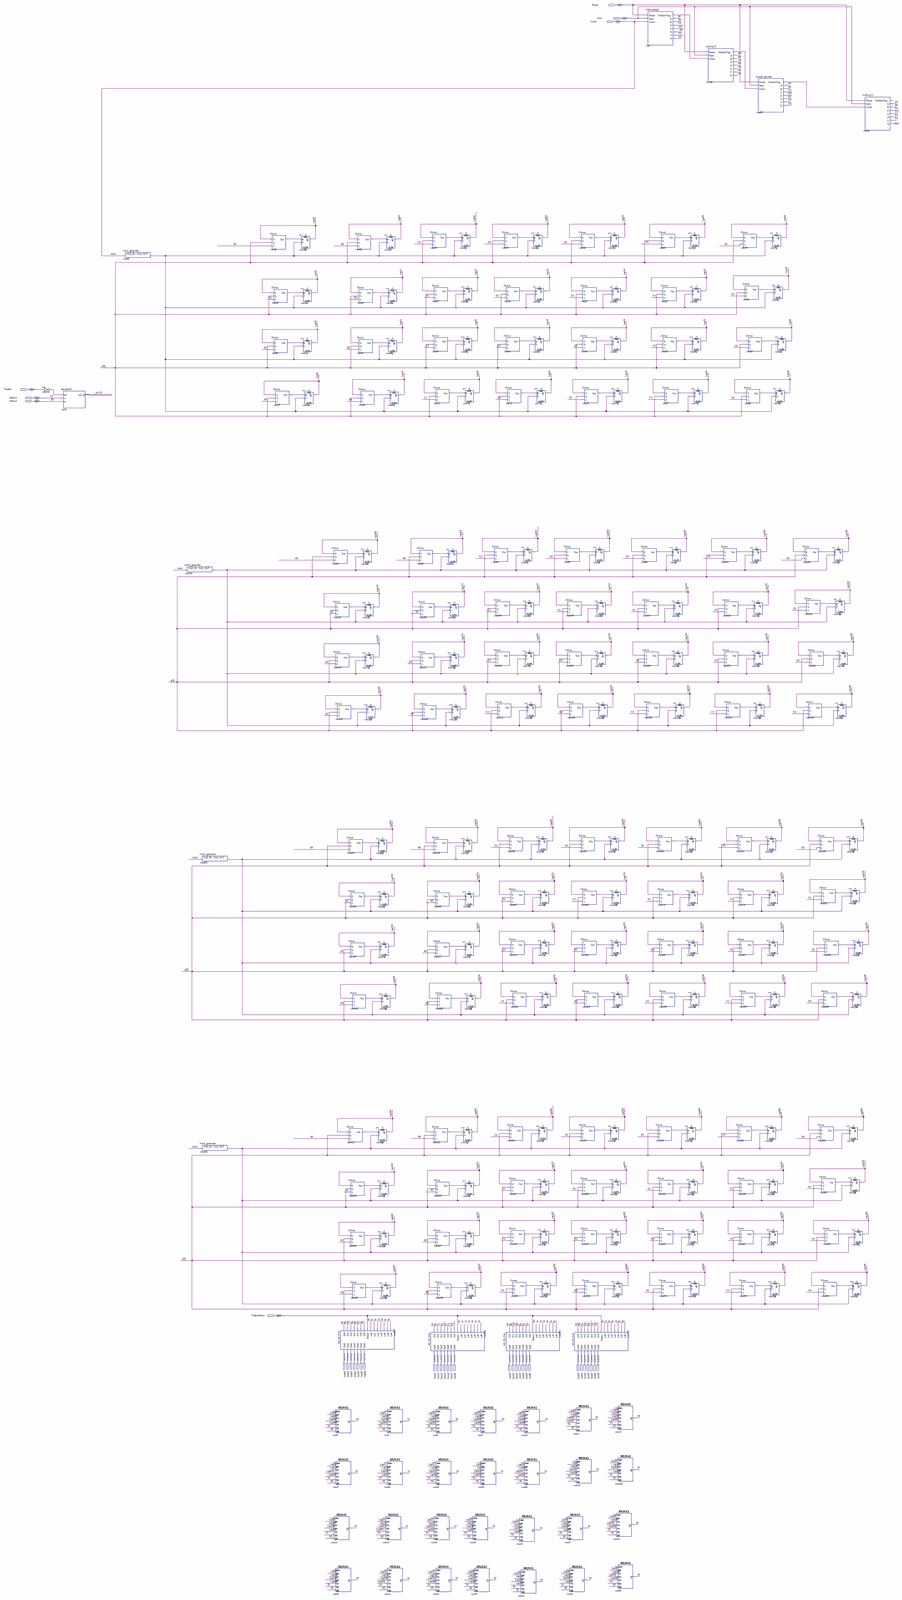
[diagram p0: schematic sheet, whole]
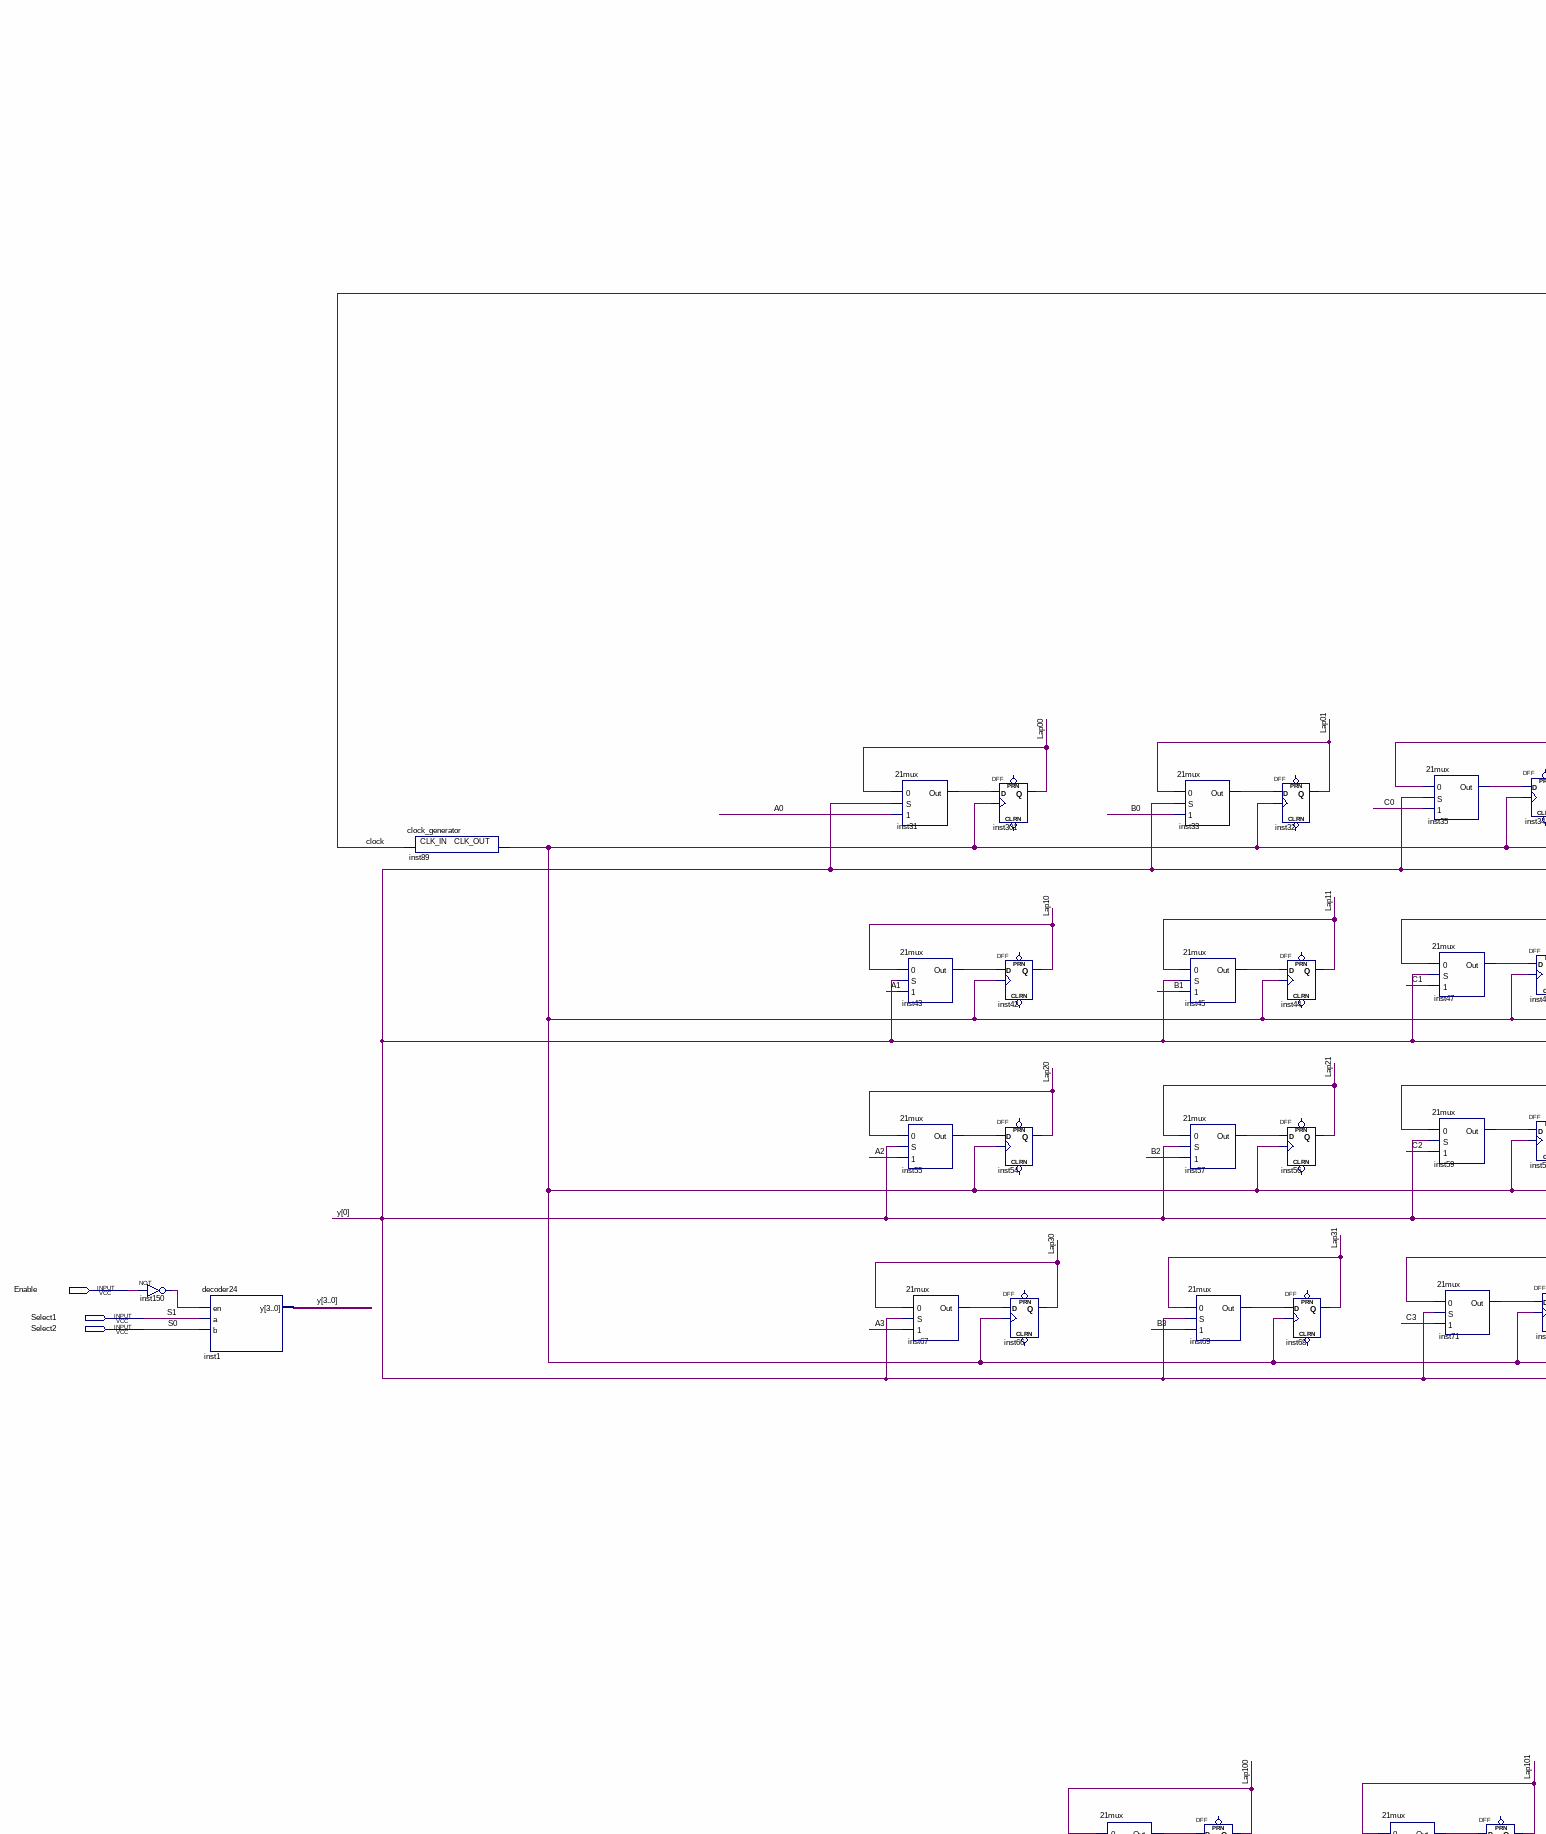
[diagram p1: schematic sheet, upper left part]
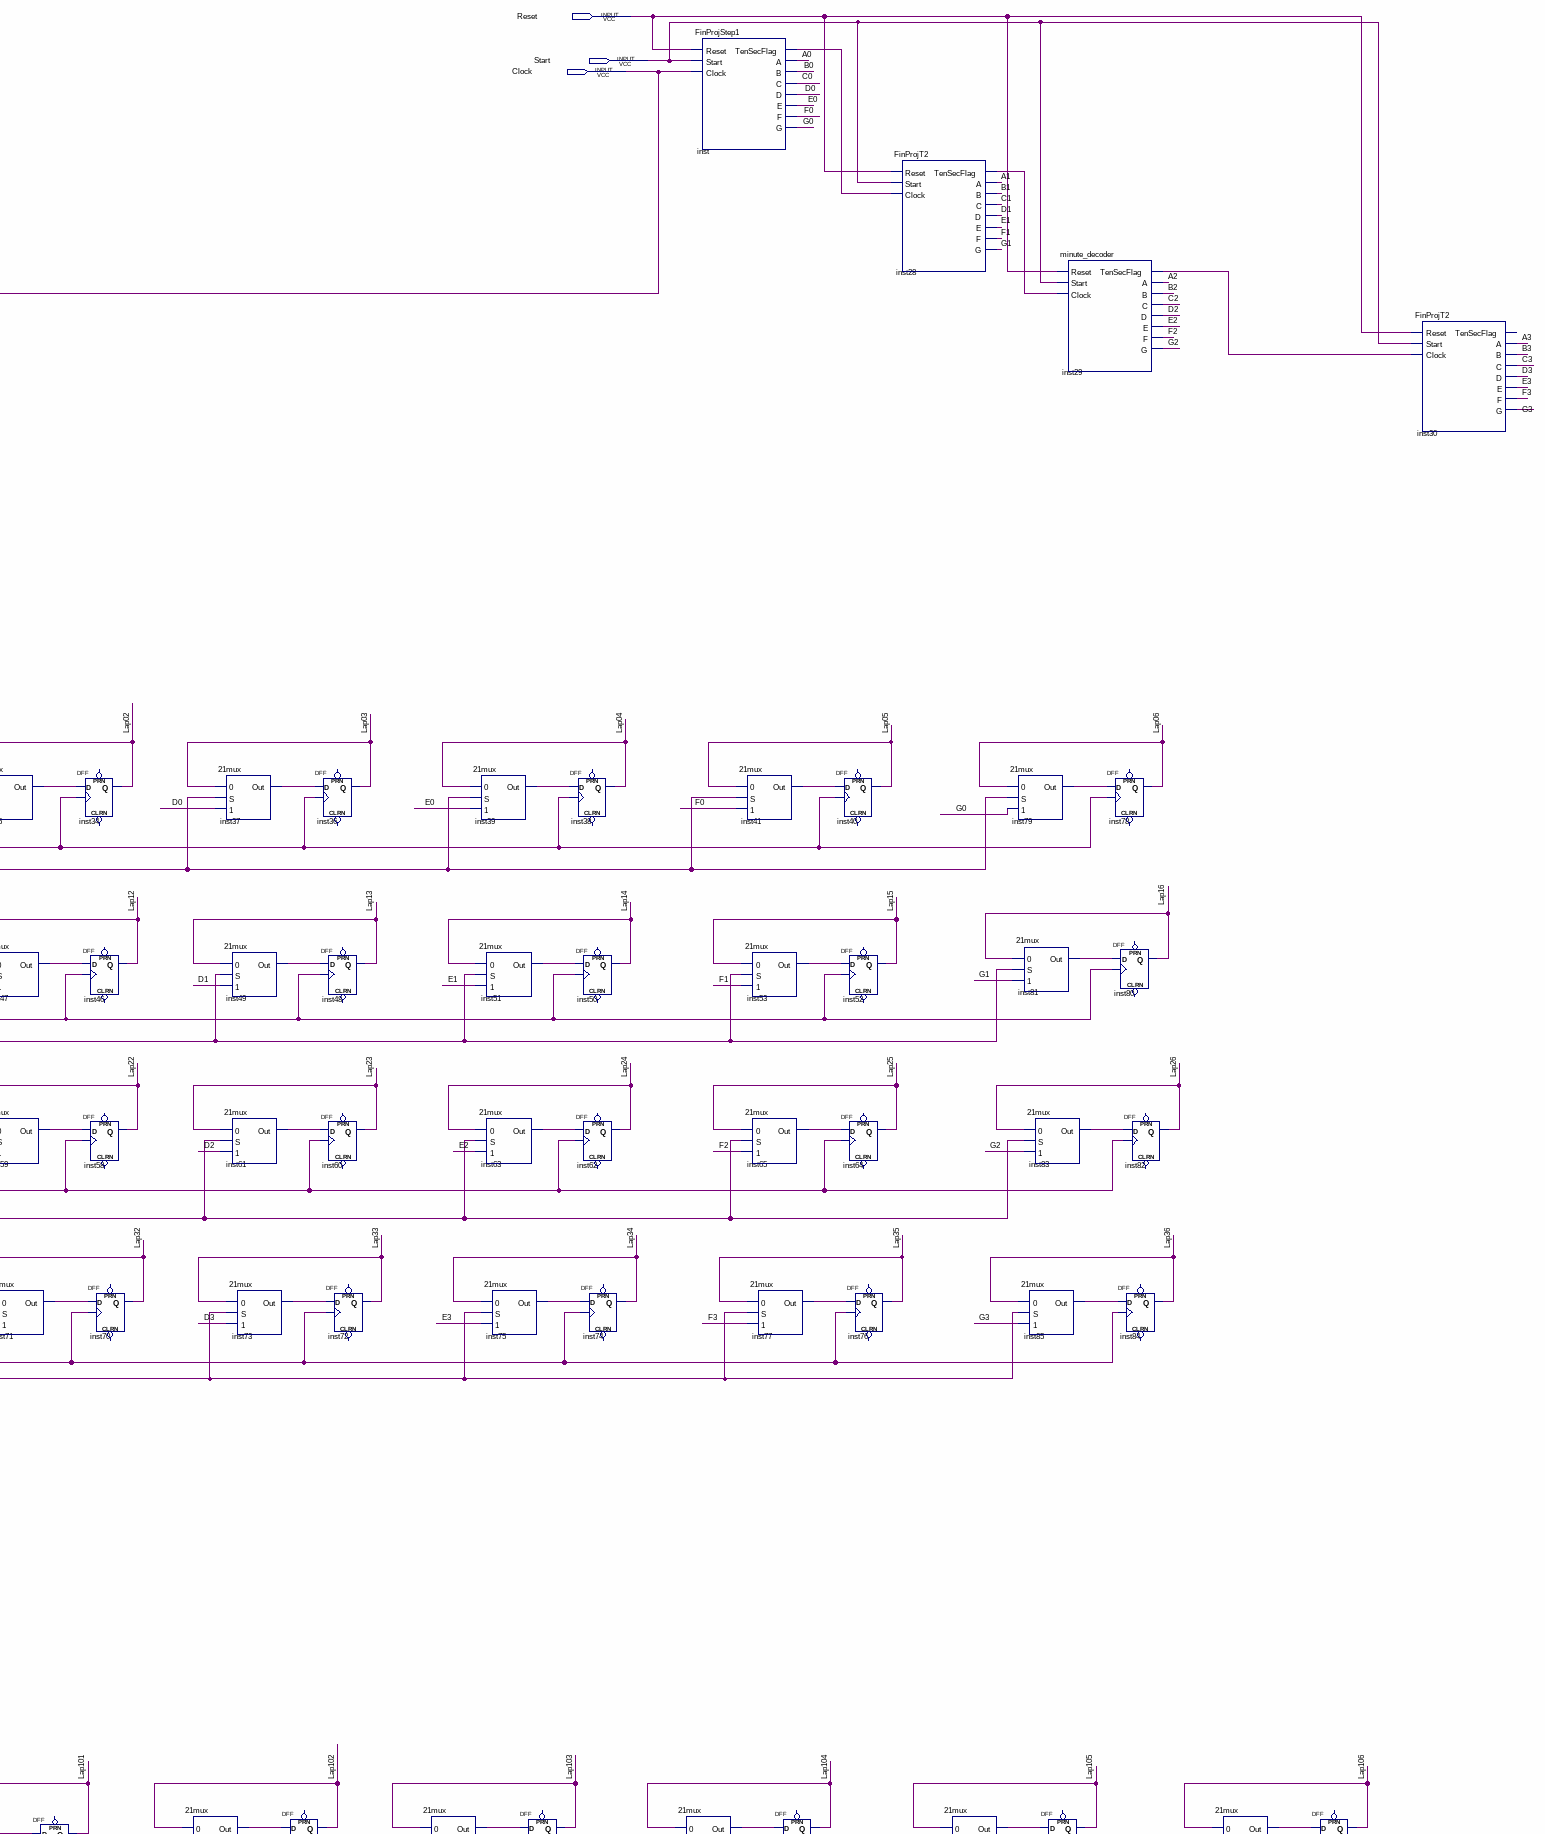
[diagram p2: schematic sheet, upper right part]
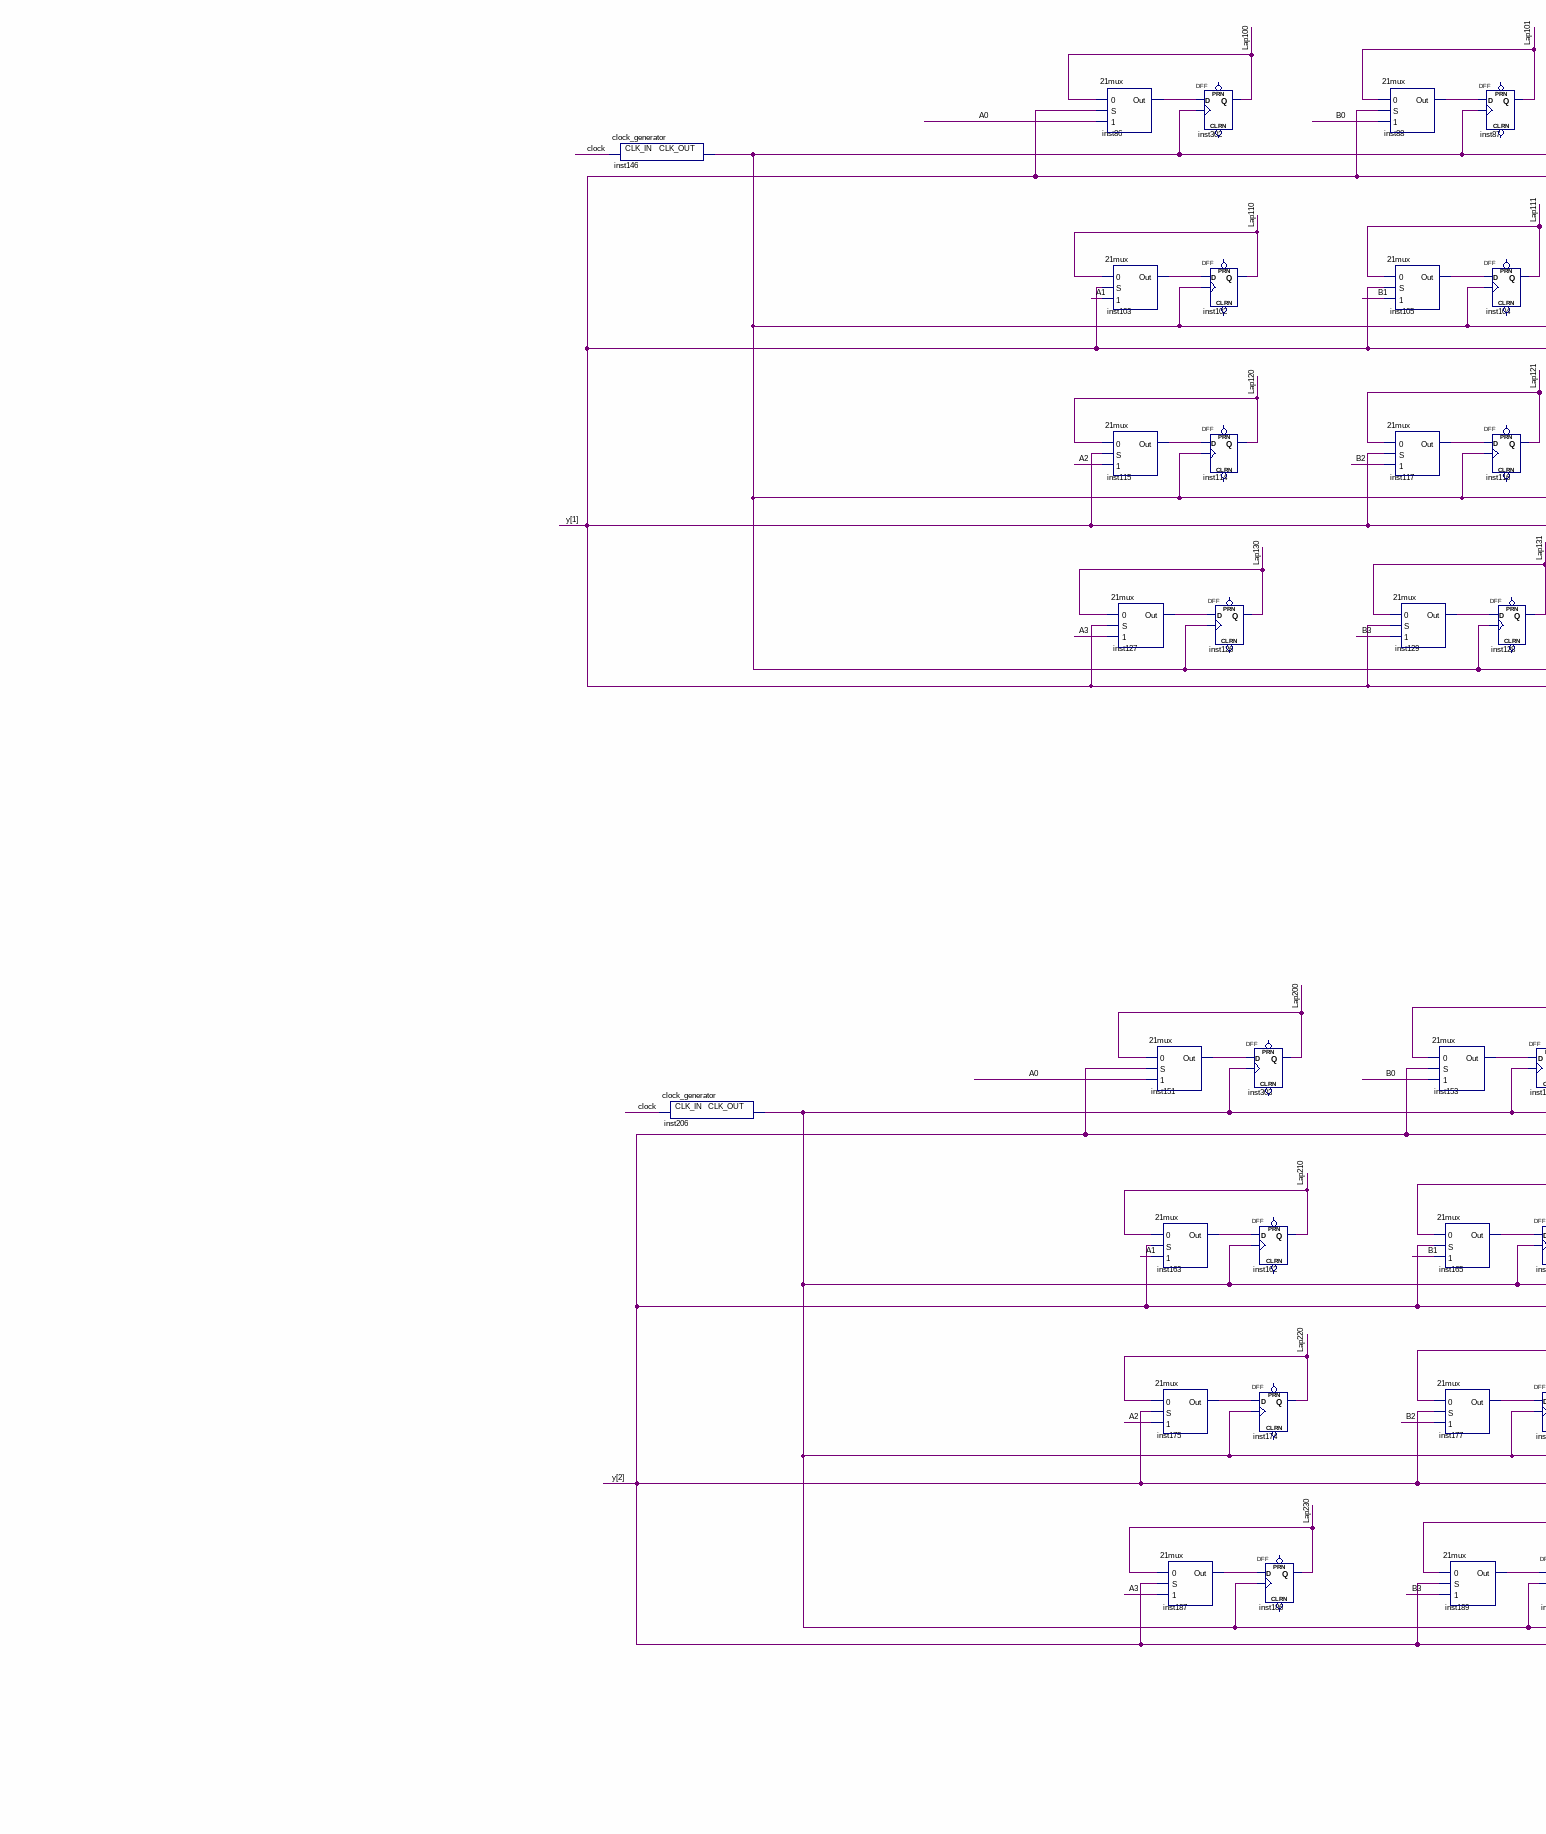
[diagram p3: schematic sheet, middle left part]
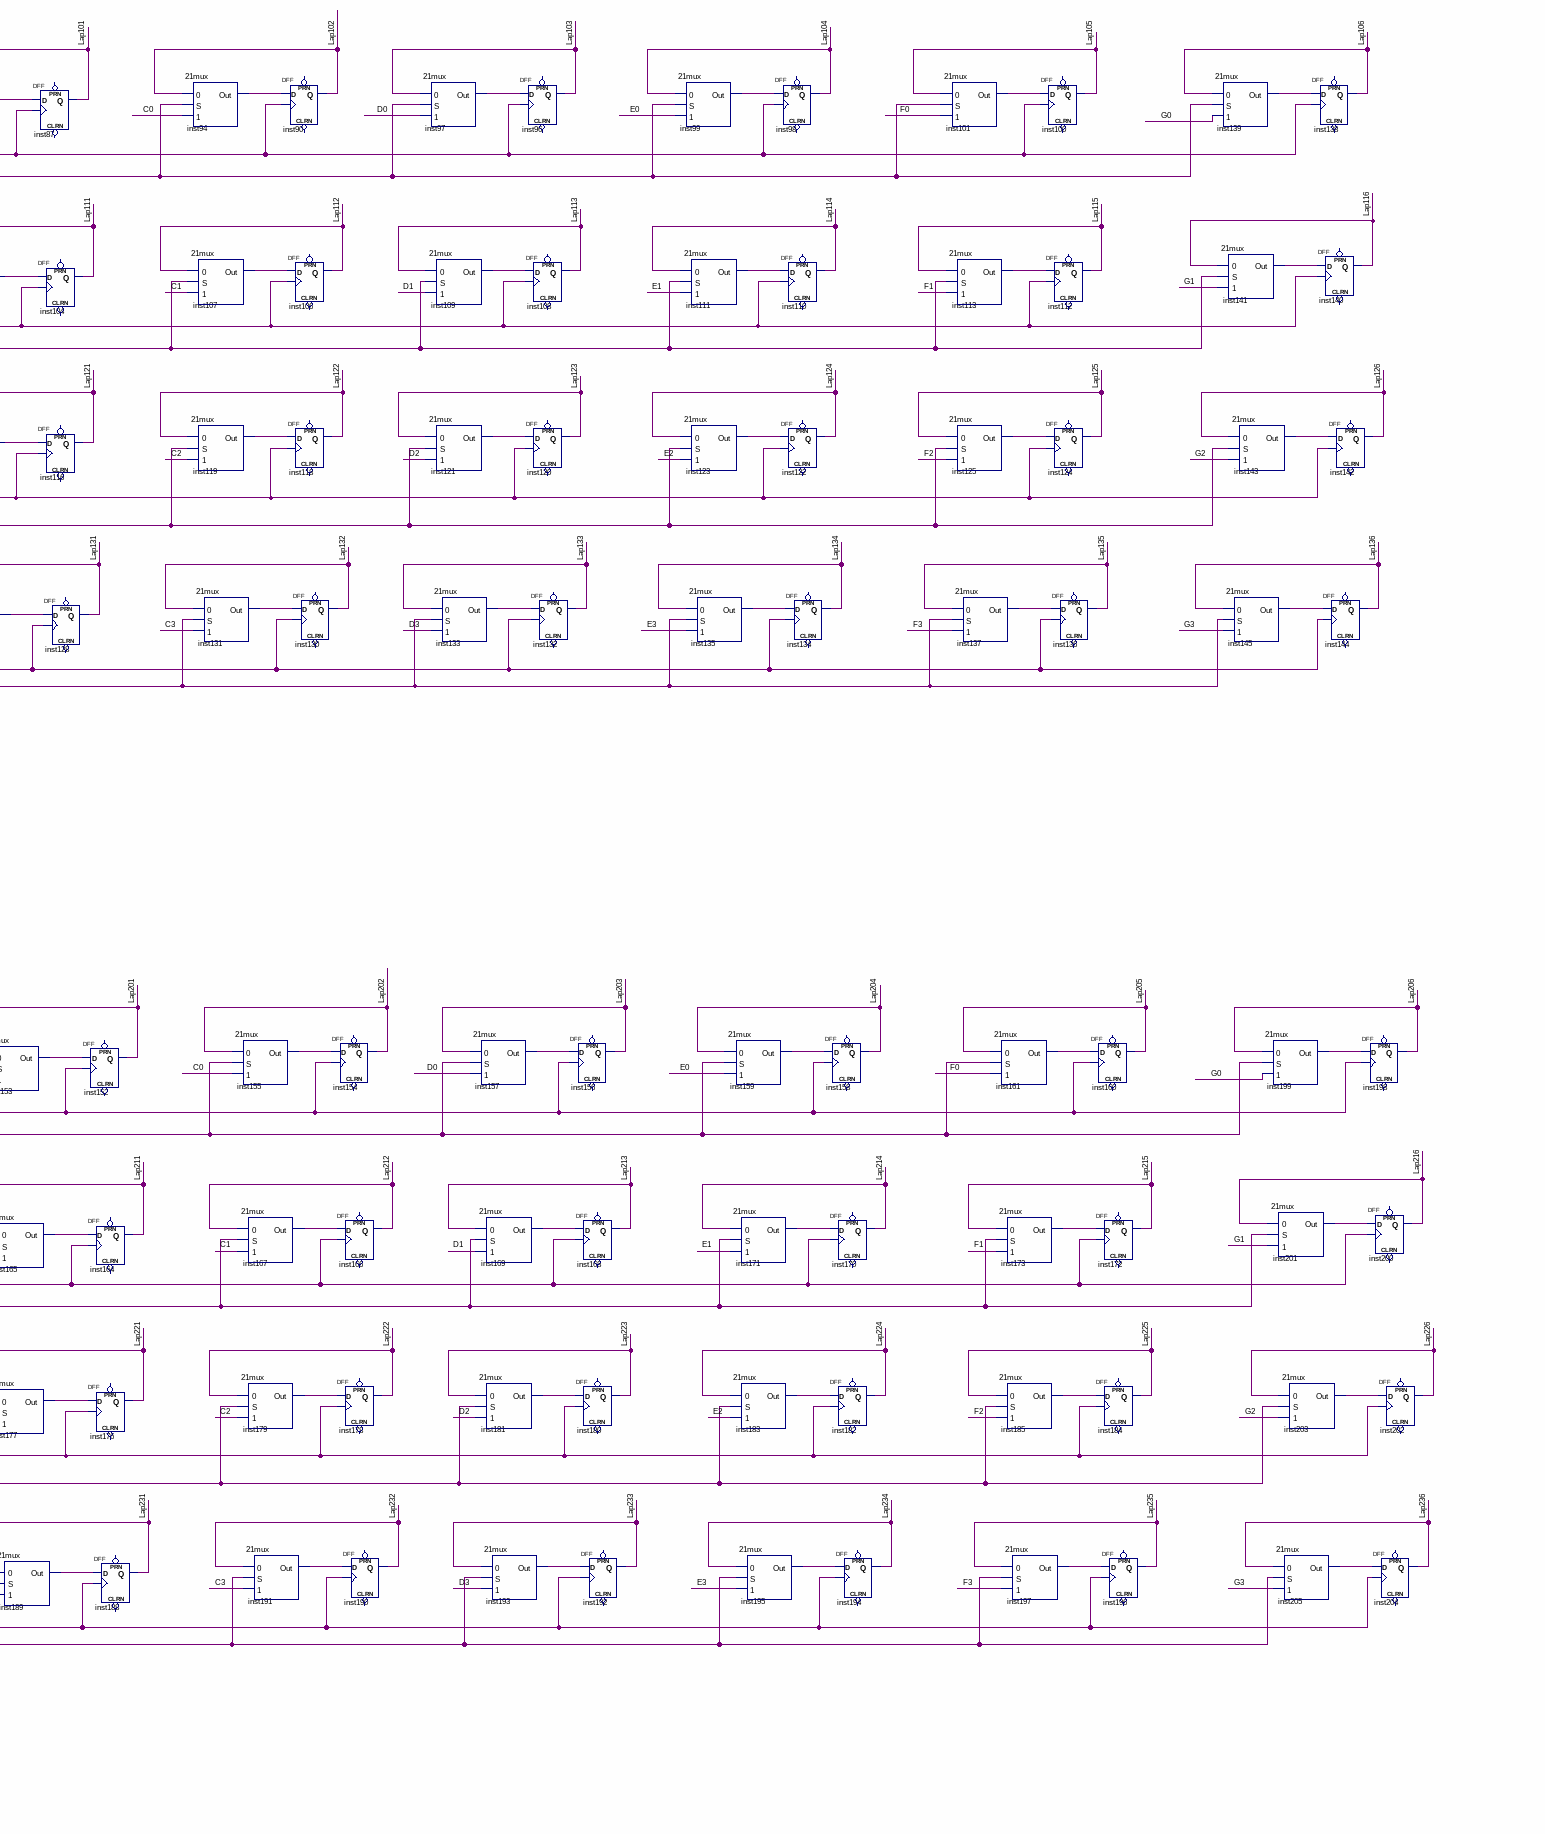
[diagram p4: schematic sheet, middle right part]
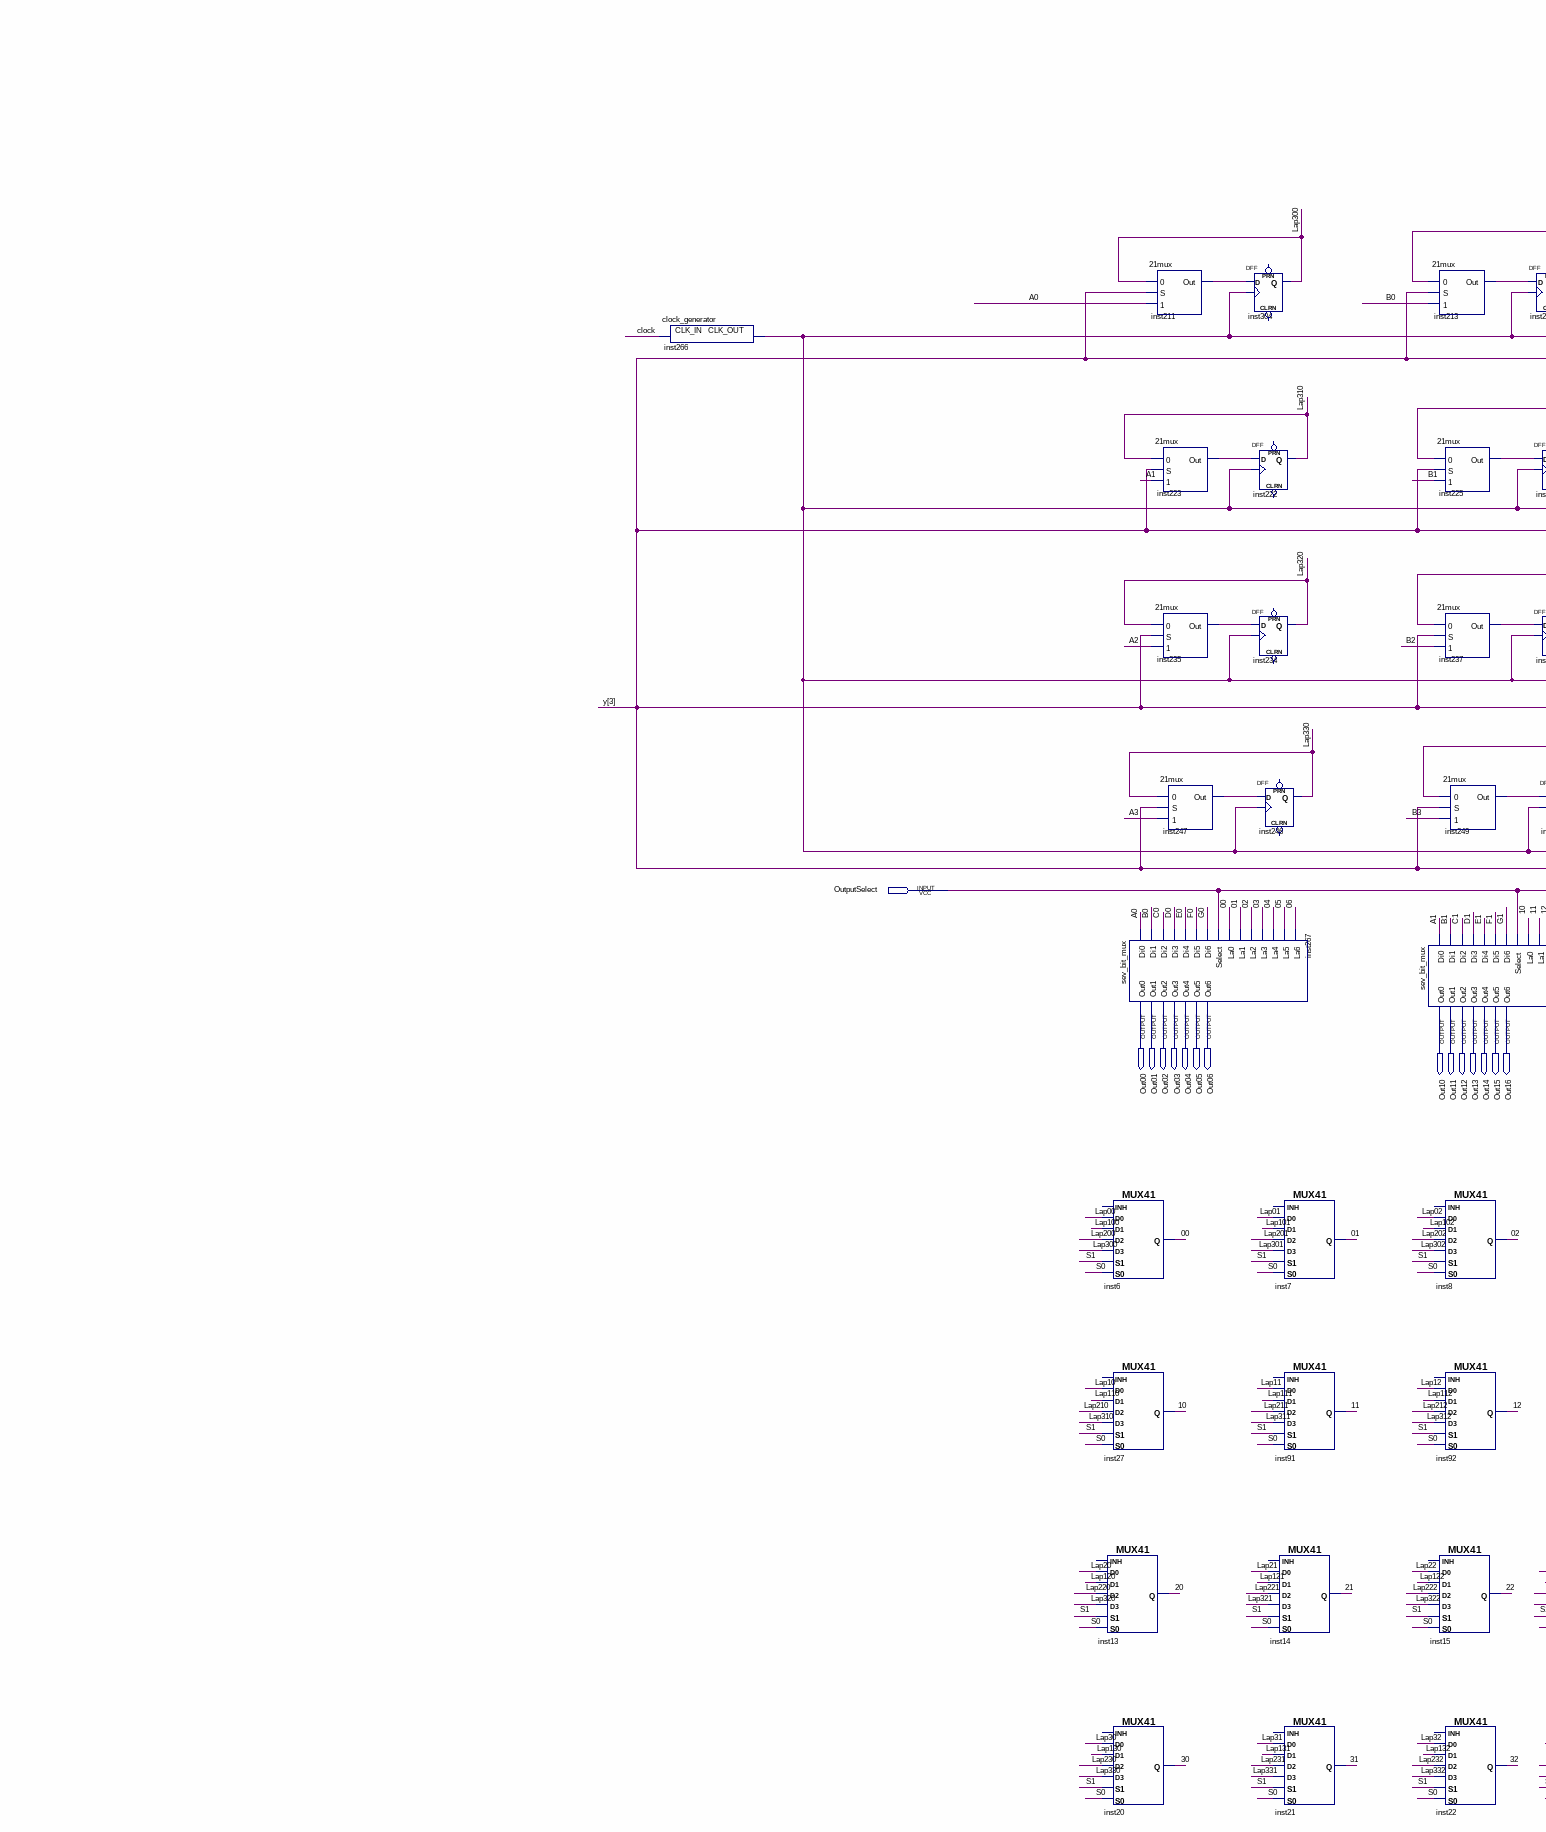
[diagram p5: schematic sheet, lower left part]
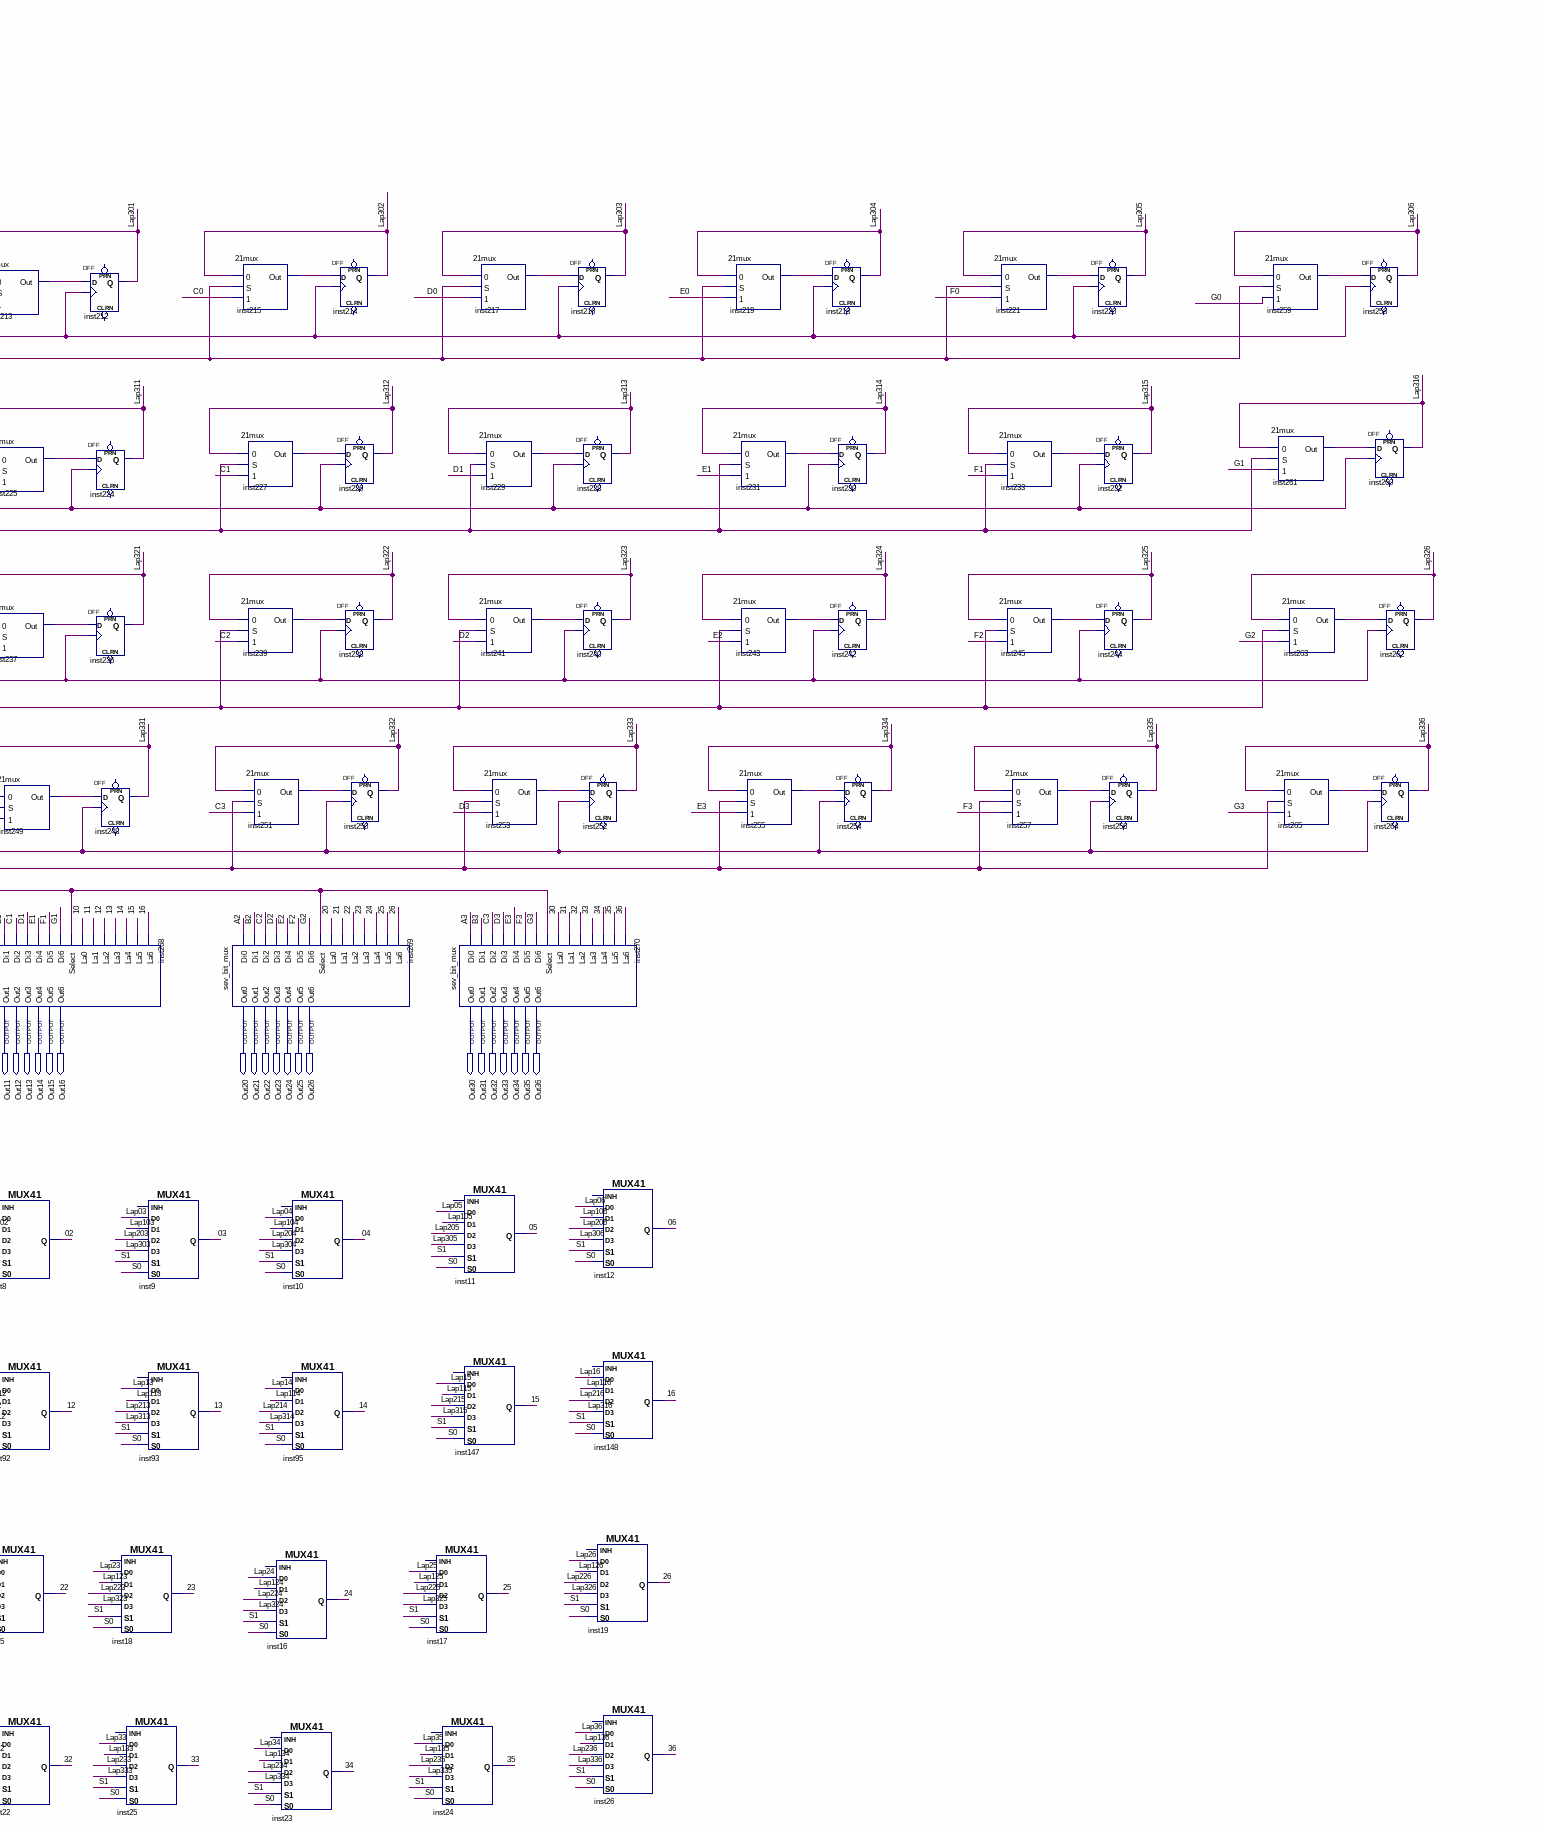
[diagram p6: schematic sheet, lower right part]
// Quartus schematic FinProjFin.bdf as structural Verilog: 266 symbols, 35 pins
module FinProjFin (
  input  Reset,
  input  Start,
  input  Clock,
  input  Enable,
  input  Select1,
  input  Select2,
  input  OutputSelect,
  output Out00,
  output Out01,
  output Out02,
  output Out03,
  output Out04,
  output Out05,
  output Out06,
  output Out10,
  output Out11,
  output Out12,
  output Out13,
  output Out14,
  output Out15,
  output Out16,
  output Out20,
  output Out21,
  output Out22,
  output Out23,
  output Out24,
  output Out25,
  output Out26,
  output Out30,
  output Out31,
  output Out32,
  output Out33,
  output Out34,
  output Out35,
  output Out36
);

  wire \00 , \01 , \02 , \03 , \04 , \05 , \06 , \10 , \11 , \12 , \13 , \14 , \15 , \16 , \20 , \21 , \22 ,
       \23 , \24 , \25 , \26 , \30 , \31 , \32 , \33 , \34 , \35 , \36 , A0, A1, A2, A3, B0, B1, B2, B3, C0,
       C1, C2, C3, D0, D1, D2, D3, E0, E1, E2, E3, F0, F1, F2, F3, G0, G1, G2, G3, inst28_tensecflag,
       inst29_tensecflag, inst31_out, inst33_out, inst35_out, inst37_out, inst39_out, inst41_out, inst43_out,
       inst45_out, inst47_out, inst49_out, inst51_out, inst53_out, inst55_out, inst57_out, inst59_out,
       inst61_out, inst63_out, inst65_out, inst67_out, inst69_out, inst71_out, inst73_out, inst75_out,
       inst77_out, inst79_out, inst81_out, inst83_out, inst85_out, inst86_out, inst88_out, inst89_clk_out,
       inst94_out, inst97_out, inst99_out, inst101_out, inst103_out, inst105_out, inst107_out, inst109_out,
       inst111_out, inst113_out, inst115_out, inst117_out, inst119_out, inst121_out, inst123_out,
       inst125_out, inst127_out, inst129_out, inst131_out, inst133_out, inst135_out, inst137_out,
       inst139_out, inst141_out, inst143_out, inst145_out, inst146_clk_out, inst150_out, inst151_out,
       inst153_out, inst155_out, inst157_out, inst159_out, inst161_out, inst163_out, inst165_out,
       inst167_out, inst169_out, inst171_out, inst173_out, inst175_out, inst177_out, inst179_out,
       inst181_out, inst183_out, inst185_out, inst187_out, inst189_out, inst191_out, inst193_out,
       inst195_out, inst197_out, inst199_out, inst201_out, inst203_out, inst205_out, inst206_clk_out,
       inst211_out, inst213_out, inst215_out, inst217_out, inst219_out, inst221_out, inst223_out,
       inst225_out, inst227_out, inst229_out, inst231_out, inst233_out, inst235_out, inst237_out,
       inst239_out, inst241_out, inst243_out, inst245_out, inst247_out, inst249_out, inst251_out,
       inst253_out, inst255_out, inst257_out, inst259_out, inst261_out, inst263_out, inst265_out,
       inst266_clk_out, inst_tensecflag, Lap00, Lap01, Lap02, Lap03, Lap04, Lap05, Lap06, Lap10, Lap11,
       Lap12, Lap13, Lap14, Lap15, Lap16, Lap20, Lap21, Lap22, Lap23, Lap24, Lap25, Lap26, Lap30, Lap31,
       Lap32, Lap33, Lap34, Lap35, Lap36, Lap100, Lap101, Lap102, Lap103, Lap104, Lap105, Lap106, Lap110,
       Lap111, Lap112, Lap113, Lap114, Lap115, Lap116, Lap120, Lap121, Lap122, Lap123, Lap124, Lap125,
       Lap126, Lap130, Lap131, Lap132, Lap133, Lap134, Lap135, Lap136, Lap200, Lap201, Lap202, Lap203,
       Lap204, Lap205, Lap206, Lap210, Lap211, Lap212, Lap213, Lap214, Lap215, Lap216, Lap220, Lap221,
       Lap222, Lap223, Lap224, Lap225, Lap226, Lap230, Lap231, Lap232, Lap233, Lap234, Lap235, Lap236,
       Lap300, Lap301, Lap302, Lap303, Lap304, Lap305, Lap306, Lap310, Lap311, Lap312, Lap313, Lap314,
       Lap315, Lap316, Lap320, Lap321, Lap322, Lap323, Lap324, Lap325, Lap326, Lap330, Lap331, Lap332,
       Lap333, Lap334, Lap335, Lap336;
  wire [3:0] y;

  not inst150 (inst150_out, Enable);
  decoder24 inst1 (.en(inst150_out), .a(Select1), .b(Select2), .y(y));
  clock_generator inst89 (.CLK_IN(Clock), .CLK_OUT(inst89_clk_out));
  clock_generator inst146 (.CLK_IN(Clock), .CLK_OUT(inst146_clk_out));
  clock_generator inst206 (.CLK_IN(Clock), .CLK_OUT(inst206_clk_out));
  clock_generator inst266 (.CLK_IN(Clock), .CLK_OUT(inst266_clk_out));
  \21mux  inst31 (.\0 (Lap00), .S(y[0]), .\1 (A0), .Out(inst31_out));
  \21mux  inst43 (.\0 (Lap10), .S(y[0]), .\1 (A1), .Out(inst43_out));
  \21mux  inst55 (.\0 (Lap20), .S(y[0]), .\1 (A2), .Out(inst55_out));
  \21mux  inst67 (.\0 (Lap30), .S(y[0]), .\1 (A3), .Out(inst67_out));
  DFF inst301 (.CLK(inst89_clk_out), .D(inst31_out), .Q(Lap00));  // open: CLRN, PRN
  DFF inst42 (.CLK(inst89_clk_out), .D(inst43_out), .Q(Lap10));  // open: CLRN, PRN
  DFF inst54 (.CLK(inst89_clk_out), .D(inst55_out), .Q(Lap20));  // open: CLRN, PRN
  DFF inst66 (.CLK(inst89_clk_out), .D(inst67_out), .Q(Lap30));  // open: CLRN, PRN
  \21mux  inst86 (.\0 (Lap100), .S(y[1]), .\1 (A0), .Out(inst86_out));
  \21mux  inst103 (.\0 (Lap110), .S(y[1]), .\1 (A1), .Out(inst103_out));
  \21mux  inst115 (.\0 (Lap120), .S(y[1]), .\1 (A2), .Out(inst115_out));
  \21mux  inst127 (.\0 (Lap130), .S(y[1]), .\1 (A3), .Out(inst127_out));
  sev_bit_mux inst267 (
    .Di0(A0), .Di1(B0), .Di2(C0), .Di3(D0), .Di4(E0), .Di5(F0), .Di6(G0), .Select(OutputSelect), .La0(\00 ),
    .La1(\01 ), .La2(\02 ), .La3(\03 ), .La4(\04 ), .La5(\05 ), .La6(\06 ), .Out0(Out00), .Out1(Out01),
    .Out2(Out02), .Out3(Out03), .Out4(Out04), .Out5(Out05), .Out6(Out06));
  MUX41 inst6 (.S0(Select2), .D2(Lap200), .S1(Select1), .D3(Lap300), .D0(Lap00), .D1(Lap100), .Q(\00 ));  // open: INH
  MUX41 inst27 (.S0(Select2), .D2(Lap210), .S1(Select1), .D3(Lap310), .D0(Lap10), .D1(Lap110), .Q(\10 ));  // open: INH
  MUX41 inst13 (.S0(Select2), .D2(Lap220), .S1(Select1), .D3(Lap320), .D0(Lap20), .D1(Lap120), .Q(\20 ));  // open: INH
  MUX41 inst20 (.S0(Select2), .D2(Lap230), .S1(Select1), .D3(Lap330), .D0(Lap30), .D1(Lap130), .Q(\30 ));  // open: INH
  \21mux  inst33 (.\0 (Lap01), .S(y[0]), .\1 (B0), .Out(inst33_out));
  \21mux  inst45 (.\0 (Lap11), .S(y[0]), .\1 (B1), .Out(inst45_out));
  \21mux  inst57 (.\0 (Lap21), .S(y[0]), .\1 (B2), .Out(inst57_out));
  \21mux  inst151 (.\0 (Lap200), .S(y[2]), .\1 (A0), .Out(inst151_out));
  \21mux  inst163 (.\0 (Lap210), .S(y[2]), .\1 (A1), .Out(inst163_out));
  \21mux  inst175 (.\0 (Lap220), .S(y[2]), .\1 (A2), .Out(inst175_out));
  \21mux  inst187 (.\0 (Lap230), .S(y[2]), .\1 (A3), .Out(inst187_out));
  \21mux  inst211 (.\0 (Lap300), .S(y[3]), .\1 (A0), .Out(inst211_out));
  \21mux  inst223 (.\0 (Lap310), .S(y[3]), .\1 (A1), .Out(inst223_out));
  \21mux  inst235 (.\0 (Lap320), .S(y[3]), .\1 (A2), .Out(inst235_out));
  \21mux  inst247 (.\0 (Lap330), .S(y[3]), .\1 (A3), .Out(inst247_out));
  \21mux  inst69 (.\0 (Lap31), .S(y[0]), .\1 (B3), .Out(inst69_out));
  DFF inst302 (.CLK(inst146_clk_out), .D(inst86_out), .Q(Lap100));  // open: CLRN, PRN
  DFF inst102 (.CLK(inst146_clk_out), .D(inst103_out), .Q(Lap110));  // open: CLRN, PRN
  DFF inst114 (.CLK(inst146_clk_out), .D(inst115_out), .Q(Lap120));  // open: CLRN, PRN
  DFF inst126 (.CLK(inst146_clk_out), .D(inst127_out), .Q(Lap130));  // open: CLRN, PRN
  DFF inst303 (.CLK(inst206_clk_out), .D(inst151_out), .Q(Lap200));  // open: CLRN, PRN
  DFF inst162 (.CLK(inst206_clk_out), .D(inst163_out), .Q(Lap210));  // open: CLRN, PRN
  DFF inst174 (.CLK(inst206_clk_out), .D(inst175_out), .Q(Lap220));  // open: CLRN, PRN
  DFF inst186 (.CLK(inst206_clk_out), .D(inst187_out), .Q(Lap230));  // open: CLRN, PRN
  DFF inst304 (.CLK(inst266_clk_out), .D(inst211_out), .Q(Lap300));  // open: CLRN, PRN
  DFF inst222 (.CLK(inst266_clk_out), .D(inst223_out), .Q(Lap310));  // open: CLRN, PRN
  DFF inst234 (.CLK(inst266_clk_out), .D(inst235_out), .Q(Lap320));  // open: CLRN, PRN
  DFF inst246 (.CLK(inst266_clk_out), .D(inst247_out), .Q(Lap330));  // open: CLRN, PRN
  MUX41 inst14 (.S0(Select2), .D2(Lap221), .S1(Select1), .D3(Lap321), .D0(Lap21), .D1(Lap121), .Q(\21 ));  // open: INH
  DFF inst32 (.CLK(inst89_clk_out), .D(inst33_out), .Q(Lap01));  // open: CLRN, PRN
  DFF inst44 (.CLK(inst89_clk_out), .D(inst45_out), .Q(Lap11));  // open: CLRN, PRN
  DFF inst56 (.CLK(inst89_clk_out), .D(inst57_out), .Q(Lap21));  // open: CLRN, PRN
  DFF inst68 (.CLK(inst89_clk_out), .D(inst69_out), .Q(Lap31));  // open: CLRN, PRN
  MUX41 inst7 (.S0(Select2), .D2(Lap201), .S1(Select1), .D3(Lap301), .D0(Lap01), .D1(Lap101), .Q(\01 ));  // open: INH
  MUX41 inst91 (.S0(Select2), .D2(Lap211), .S1(Select1), .D3(Lap311), .D0(Lap11), .D1(Lap111), .Q(\11 ));  // open: INH
  MUX41 inst21 (.S0(Select2), .D2(Lap231), .S1(Select1), .D3(Lap331), .D0(Lap31), .D1(Lap131), .Q(\31 ));  // open: INH
  \21mux  inst88 (.\0 (Lap101), .S(y[1]), .\1 (B0), .Out(inst88_out));
  \21mux  inst105 (.\0 (Lap111), .S(y[1]), .\1 (B1), .Out(inst105_out));
  \21mux  inst117 (.\0 (Lap121), .S(y[1]), .\1 (B2), .Out(inst117_out));
  \21mux  inst129 (.\0 (Lap131), .S(y[1]), .\1 (B3), .Out(inst129_out));
  \21mux  inst35 (.\0 (Lap02), .S(y[0]), .\1 (C0), .Out(inst35_out));
  \21mux  inst47 (.\0 (Lap12), .S(y[0]), .\1 (C1), .Out(inst47_out));
  \21mux  inst59 (.\0 (Lap22), .S(y[0]), .\1 (C2), .Out(inst59_out));
  \21mux  inst71 (.\0 (Lap32), .S(y[0]), .\1 (C3), .Out(inst71_out));
  \21mux  inst153 (.\0 (Lap201), .S(y[2]), .\1 (B0), .Out(inst153_out));
  \21mux  inst165 (.\0 (Lap211), .S(y[2]), .\1 (B1), .Out(inst165_out));
  \21mux  inst177 (.\0 (Lap221), .S(y[2]), .\1 (B2), .Out(inst177_out));
  \21mux  inst189 (.\0 (Lap231), .S(y[2]), .\1 (B3), .Out(inst189_out));
  \21mux  inst213 (.\0 (Lap301), .S(y[3]), .\1 (B0), .Out(inst213_out));
  \21mux  inst225 (.\0 (Lap311), .S(y[3]), .\1 (B1), .Out(inst225_out));
  \21mux  inst237 (.\0 (Lap321), .S(y[3]), .\1 (B2), .Out(inst237_out));
  \21mux  inst249 (.\0 (Lap331), .S(y[3]), .\1 (B3), .Out(inst249_out));
  sev_bit_mux inst268 (
    .Di0(A1), .Di1(B1), .Di2(C1), .Di3(D1), .Di4(E1), .Di5(F1), .Di6(G1), .Select(OutputSelect), .La0(\10 ),
    .La1(\11 ), .La2(\12 ), .La3(\13 ), .La4(\14 ), .La5(\15 ), .La6(\16 ), .Out0(Out10), .Out1(Out11),
    .Out2(Out12), .Out3(Out13), .Out4(Out14), .Out5(Out15), .Out6(Out16));
  MUX41 inst8 (.S0(Select2), .D2(Lap202), .S1(Select1), .D3(Lap302), .D0(Lap02), .D1(Lap102), .Q(\02 ));  // open: INH
  MUX41 inst92 (.S0(Select2), .D2(Lap212), .S1(Select1), .D3(Lap312), .D0(Lap12), .D1(Lap112), .Q(\12 ));  // open: INH
  MUX41 inst15 (.S0(Select2), .D2(Lap222), .S1(Select1), .D3(Lap322), .D0(Lap22), .D1(Lap122), .Q(\22 ));  // open: INH
  MUX41 inst22 (.S0(Select2), .D2(Lap232), .S1(Select1), .D3(Lap332), .D0(Lap32), .D1(Lap132), .Q(\32 ));  // open: INH
  DFF inst87 (.CLK(inst146_clk_out), .D(inst88_out), .Q(Lap101));  // open: CLRN, PRN
  DFF inst104 (.CLK(inst146_clk_out), .D(inst105_out), .Q(Lap111));  // open: CLRN, PRN
  DFF inst116 (.CLK(inst146_clk_out), .D(inst117_out), .Q(Lap121));  // open: CLRN, PRN
  DFF inst128 (.CLK(inst146_clk_out), .D(inst129_out), .Q(Lap131));  // open: CLRN, PRN
  DFF inst34 (.CLK(inst89_clk_out), .D(inst35_out), .Q(Lap02));  // open: CLRN, PRN
  DFF inst46 (.CLK(inst89_clk_out), .D(inst47_out), .Q(Lap12));  // open: CLRN, PRN
  DFF inst58 (.CLK(inst89_clk_out), .D(inst59_out), .Q(Lap22));  // open: CLRN, PRN
  DFF inst70 (.CLK(inst89_clk_out), .D(inst71_out), .Q(Lap32));  // open: CLRN, PRN
  DFF inst152 (.CLK(inst206_clk_out), .D(inst153_out), .Q(Lap201));  // open: CLRN, PRN
  DFF inst164 (.CLK(inst206_clk_out), .D(inst165_out), .Q(Lap211));  // open: CLRN, PRN
  DFF inst176 (.CLK(inst206_clk_out), .D(inst177_out), .Q(Lap221));  // open: CLRN, PRN
  DFF inst212 (.CLK(inst266_clk_out), .D(inst213_out), .Q(Lap301));  // open: CLRN, PRN
  DFF inst224 (.CLK(inst266_clk_out), .D(inst225_out), .Q(Lap311));  // open: CLRN, PRN
  DFF inst236 (.CLK(inst266_clk_out), .D(inst237_out), .Q(Lap321));  // open: CLRN, PRN
  DFF inst188 (.CLK(inst206_clk_out), .D(inst189_out), .Q(Lap231));  // open: CLRN, PRN
  DFF inst248 (.CLK(inst266_clk_out), .D(inst249_out), .Q(Lap331));  // open: CLRN, PRN
  MUX41 inst18 (.S0(Select2), .D2(Lap223), .S1(Select1), .D3(Lap323), .D0(Lap23), .D1(Lap123), .Q(\23 ));  // open: INH
  MUX41 inst25 (.S0(Select2), .D2(Lap233), .S1(Select1), .D3(Lap333), .D0(Lap33), .D1(Lap133), .Q(\33 ));  // open: INH
  MUX41 inst9 (.S0(Select2), .D2(Lap203), .S1(Select1), .D3(Lap303), .D0(Lap03), .D1(Lap103), .Q(\03 ));  // open: INH
  MUX41 inst93 (.S0(Select2), .D2(Lap213), .S1(Select1), .D3(Lap313), .D0(Lap13), .D1(Lap113), .Q(\13 ));  // open: INH
  \21mux  inst37 (.\0 (Lap03), .S(y[0]), .\1 (D0), .Out(inst37_out));
  \21mux  inst49 (.\0 (Lap13), .S(y[0]), .\1 (D1), .Out(inst49_out));
  \21mux  inst61 (.\0 (Lap23), .S(y[0]), .\1 (D2), .Out(inst61_out));
  \21mux  inst94 (.\0 (Lap102), .S(y[1]), .\1 (C0), .Out(inst94_out));
  \21mux  inst107 (.\0 (Lap112), .S(y[1]), .\1 (C1), .Out(inst107_out));
  \21mux  inst119 (.\0 (Lap122), .S(y[1]), .\1 (C2), .Out(inst119_out));
  \21mux  inst131 (.\0 (Lap132), .S(y[1]), .\1 (C3), .Out(inst131_out));
  sev_bit_mux inst269 (
    .Di0(A2), .Di1(B2), .Di2(C2), .Di3(D2), .Di4(E2), .Di5(F2), .Di6(G2), .Select(OutputSelect), .La0(\20 ),
    .La1(\21 ), .La2(\22 ), .La3(\23 ), .La4(\24 ), .La5(\25 ), .La6(\26 ), .Out0(Out20), .Out1(Out21),
    .Out2(Out22), .Out3(Out23), .Out4(Out24), .Out5(Out25), .Out6(Out26));
  \21mux  inst73 (.\0 (Lap33), .S(y[0]), .\1 (D3), .Out(inst73_out));
  \21mux  inst155 (.\0 (Lap202), .S(y[2]), .\1 (C0), .Out(inst155_out));
  \21mux  inst167 (.\0 (Lap212), .S(y[2]), .\1 (C1), .Out(inst167_out));
  \21mux  inst179 (.\0 (Lap222), .S(y[2]), .\1 (C2), .Out(inst179_out));
  \21mux  inst191 (.\0 (Lap232), .S(y[2]), .\1 (C3), .Out(inst191_out));
  \21mux  inst215 (.\0 (Lap302), .S(y[3]), .\1 (C0), .Out(inst215_out));
  \21mux  inst227 (.\0 (Lap312), .S(y[3]), .\1 (C1), .Out(inst227_out));
  \21mux  inst239 (.\0 (Lap322), .S(y[3]), .\1 (C2), .Out(inst239_out));
  \21mux  inst251 (.\0 (Lap332), .S(y[3]), .\1 (C3), .Out(inst251_out));
  MUX41 inst16 (.S0(Select2), .D2(Lap224), .S1(Select1), .D3(Lap324), .D0(Lap24), .D1(Lap124), .Q(\24 ));  // open: INH
  DFF inst90 (.CLK(inst146_clk_out), .D(inst94_out), .Q(Lap102));  // open: CLRN, PRN
  DFF inst106 (.CLK(inst146_clk_out), .D(inst107_out), .Q(Lap112));  // open: CLRN, PRN
  DFF inst118 (.CLK(inst146_clk_out), .D(inst119_out), .Q(Lap122));  // open: CLRN, PRN
  DFF inst130 (.CLK(inst146_clk_out), .D(inst131_out), .Q(Lap132));  // open: CLRN, PRN
  MUX41 inst10 (.S0(Select2), .D2(Lap204), .S1(Select1), .D3(Lap304), .D0(Lap04), .D1(Lap104), .Q(\04 ));  // open: INH
  MUX41 inst95 (.S0(Select2), .D2(Lap214), .S1(Select1), .D3(Lap314), .D0(Lap14), .D1(Lap114), .Q(\14 ));  // open: INH
  MUX41 inst23 (.S0(Select2), .D2(Lap234), .S1(Select1), .D3(Lap334), .D0(Lap34), .D1(Lap134), .Q(\34 ));  // open: INH
  DFF inst36 (.CLK(inst89_clk_out), .D(inst37_out), .Q(Lap03));  // open: CLRN, PRN
  DFF inst48 (.CLK(inst89_clk_out), .D(inst49_out), .Q(Lap13));  // open: CLRN, PRN
  DFF inst60 (.CLK(inst89_clk_out), .D(inst61_out), .Q(Lap23));  // open: CLRN, PRN
  DFF inst72 (.CLK(inst89_clk_out), .D(inst73_out), .Q(Lap33));  // open: CLRN, PRN
  DFF inst154 (.CLK(inst206_clk_out), .D(inst155_out), .Q(Lap202));  // open: CLRN, PRN
  DFF inst166 (.CLK(inst206_clk_out), .D(inst167_out), .Q(Lap212));  // open: CLRN, PRN
  DFF inst178 (.CLK(inst206_clk_out), .D(inst179_out), .Q(Lap222));  // open: CLRN, PRN
  DFF inst190 (.CLK(inst206_clk_out), .D(inst191_out), .Q(Lap232));  // open: CLRN, PRN
  DFF inst214 (.CLK(inst266_clk_out), .D(inst215_out), .Q(Lap302));  // open: CLRN, PRN
  DFF inst226 (.CLK(inst266_clk_out), .D(inst227_out), .Q(Lap312));  // open: CLRN, PRN
  DFF inst238 (.CLK(inst266_clk_out), .D(inst239_out), .Q(Lap322));  // open: CLRN, PRN
  DFF inst250 (.CLK(inst266_clk_out), .D(inst251_out), .Q(Lap332));  // open: CLRN, PRN
  \21mux  inst97 (.\0 (Lap103), .S(y[1]), .\1 (D0), .Out(inst97_out));
  \21mux  inst109 (.\0 (Lap113), .S(y[1]), .\1 (D1), .Out(inst109_out));
  \21mux  inst121 (.\0 (Lap123), .S(y[1]), .\1 (D2), .Out(inst121_out));
  \21mux  inst133 (.\0 (Lap133), .S(y[1]), .\1 (D3), .Out(inst133_out));
  MUX41 inst17 (.S0(Select2), .D2(Lap225), .S1(Select1), .D3(Lap325), .D0(Lap25), .D1(Lap125), .Q(\25 ));  // open: INH
  MUX41 inst24 (.S0(Select2), .D2(Lap235), .S1(Select1), .D3(Lap335), .D0(Lap35), .D1(Lap135), .Q(\35 ));  // open: INH
  \21mux  inst39 (.\0 (Lap04), .S(y[0]), .\1 (E0), .Out(inst39_out));
  \21mux  inst51 (.\0 (Lap14), .S(y[0]), .\1 (E1), .Out(inst51_out));
  \21mux  inst63 (.\0 (Lap24), .S(y[0]), .\1 (E2), .Out(inst63_out));
  \21mux  inst75 (.\0 (Lap34), .S(y[0]), .\1 (E3), .Out(inst75_out));
  \21mux  inst157 (.\0 (Lap203), .S(y[2]), .\1 (D0), .Out(inst157_out));
  \21mux  inst169 (.\0 (Lap213), .S(y[2]), .\1 (D1), .Out(inst169_out));
  \21mux  inst181 (.\0 (Lap223), .S(y[2]), .\1 (D2), .Out(inst181_out));
  \21mux  inst193 (.\0 (Lap233), .S(y[2]), .\1 (D3), .Out(inst193_out));
  \21mux  inst217 (.\0 (Lap303), .S(y[3]), .\1 (D0), .Out(inst217_out));
  \21mux  inst229 (.\0 (Lap313), .S(y[3]), .\1 (D1), .Out(inst229_out));
  \21mux  inst241 (.\0 (Lap323), .S(y[3]), .\1 (D2), .Out(inst241_out));
  \21mux  inst253 (.\0 (Lap333), .S(y[3]), .\1 (D3), .Out(inst253_out));
  sev_bit_mux inst270 (
    .Di0(A3), .Di1(B3), .Di2(C3), .Di3(D3), .Di4(E3), .Di5(F3), .Di6(G3), .Select(OutputSelect), .La0(\30 ),
    .La1(\31 ), .La2(\32 ), .La3(\33 ), .La4(\34 ), .La5(\35 ), .La6(\36 ), .Out0(Out30), .Out1(Out31),
    .Out2(Out32), .Out3(Out33), .Out4(Out34), .Out5(Out35), .Out6(Out36));
  MUX41 inst11 (.S0(Select2), .D2(Lap205), .S1(Select1), .D3(Lap305), .D0(Lap05), .D1(Lap105), .Q(\05 ));  // open: INH
  MUX41 inst147 (.S0(Select2), .D2(Lap215), .S1(Select1), .D3(Lap315), .D0(Lap15), .D1(Lap115), .Q(\15 ));  // open: INH
  DFF inst96 (.CLK(inst146_clk_out), .D(inst97_out), .Q(Lap103));  // open: CLRN, PRN
  DFF inst108 (.CLK(inst146_clk_out), .D(inst109_out), .Q(Lap113));  // open: CLRN, PRN
  DFF inst120 (.CLK(inst146_clk_out), .D(inst121_out), .Q(Lap123));  // open: CLRN, PRN
  DFF inst132 (.CLK(inst146_clk_out), .D(inst133_out), .Q(Lap133));  // open: CLRN, PRN
  DFF inst38 (.CLK(inst89_clk_out), .D(inst39_out), .Q(Lap04));  // open: CLRN, PRN
  DFF inst50 (.CLK(inst89_clk_out), .D(inst51_out), .Q(Lap14));  // open: CLRN, PRN
  DFF inst62 (.CLK(inst89_clk_out), .D(inst63_out), .Q(Lap24));  // open: CLRN, PRN
  DFF inst156 (.CLK(inst206_clk_out), .D(inst157_out), .Q(Lap203));  // open: CLRN, PRN
  DFF inst168 (.CLK(inst206_clk_out), .D(inst169_out), .Q(Lap213));  // open: CLRN, PRN
  DFF inst180 (.CLK(inst206_clk_out), .D(inst181_out), .Q(Lap223));  // open: CLRN, PRN
  DFF inst216 (.CLK(inst266_clk_out), .D(inst217_out), .Q(Lap303));  // open: CLRN, PRN
  DFF inst228 (.CLK(inst266_clk_out), .D(inst229_out), .Q(Lap313));  // open: CLRN, PRN
  DFF inst240 (.CLK(inst266_clk_out), .D(inst241_out), .Q(Lap323));  // open: CLRN, PRN
  DFF inst74 (.CLK(inst89_clk_out), .D(inst75_out), .Q(Lap34));  // open: CLRN, PRN
  DFF inst192 (.CLK(inst206_clk_out), .D(inst193_out), .Q(Lap233));  // open: CLRN, PRN
  DFF inst252 (.CLK(inst266_clk_out), .D(inst253_out), .Q(Lap333));  // open: CLRN, PRN
  MUX41 inst12 (.S0(Select2), .D2(Lap206), .S1(Select1), .D3(Lap306), .D0(Lap06), .D1(Lap106), .Q(\06 ));  // open: INH
  MUX41 inst148 (.S0(Select2), .D2(Lap216), .S1(Select1), .D3(Lap316), .D0(Lap16), .D1(Lap116), .Q(\16 ));  // open: INH
  MUX41 inst19 (.S0(Select2), .D2(Lap226), .S1(Select1), .D3(Lap326), .D0(Lap26), .D1(Lap126), .Q(\26 ));  // open: INH
  MUX41 inst26 (.S0(Select2), .D2(Lap236), .S1(Select1), .D3(Lap336), .D0(Lap36), .D1(Lap136), .Q(\36 ));  // open: INH
  FinProjStep1 inst (
    .Reset(Reset), .Start(Start), .Clock(Clock), .TenSecFlag(inst_tensecflag), .A(A0), .B(B0), .C(C0),
    .D(D0), .E(E0), .F(F0), .G(G0));
  \21mux  inst99 (.\0 (Lap104), .S(y[1]), .\1 (E0), .Out(inst99_out));
  \21mux  inst111 (.\0 (Lap114), .S(y[1]), .\1 (E1), .Out(inst111_out));
  \21mux  inst123 (.\0 (Lap124), .S(y[1]), .\1 (E2), .Out(inst123_out));
  \21mux  inst135 (.\0 (Lap134), .S(y[1]), .\1 (E3), .Out(inst135_out));
  \21mux  inst41 (.\0 (Lap05), .S(y[0]), .\1 (F0), .Out(inst41_out));
  \21mux  inst53 (.\0 (Lap15), .S(y[0]), .\1 (F1), .Out(inst53_out));
  \21mux  inst65 (.\0 (Lap25), .S(y[0]), .\1 (F2), .Out(inst65_out));
  \21mux  inst77 (.\0 (Lap35), .S(y[0]), .\1 (F3), .Out(inst77_out));
  \21mux  inst159 (.\0 (Lap204), .S(y[2]), .\1 (E0), .Out(inst159_out));
  \21mux  inst171 (.\0 (Lap214), .S(y[2]), .\1 (E1), .Out(inst171_out));
  \21mux  inst183 (.\0 (Lap224), .S(y[2]), .\1 (E2), .Out(inst183_out));
  \21mux  inst195 (.\0 (Lap234), .S(y[2]), .\1 (E3), .Out(inst195_out));
  \21mux  inst219 (.\0 (Lap304), .S(y[3]), .\1 (E0), .Out(inst219_out));
  \21mux  inst231 (.\0 (Lap314), .S(y[3]), .\1 (E1), .Out(inst231_out));
  \21mux  inst243 (.\0 (Lap324), .S(y[3]), .\1 (E2), .Out(inst243_out));
  \21mux  inst255 (.\0 (Lap334), .S(y[3]), .\1 (E3), .Out(inst255_out));
  DFF inst98 (.CLK(inst146_clk_out), .D(inst99_out), .Q(Lap104));  // open: CLRN, PRN
  DFF inst110 (.CLK(inst146_clk_out), .D(inst111_out), .Q(Lap114));  // open: CLRN, PRN
  DFF inst122 (.CLK(inst146_clk_out), .D(inst123_out), .Q(Lap124));  // open: CLRN, PRN
  DFF inst134 (.CLK(inst146_clk_out), .D(inst135_out), .Q(Lap134));  // open: CLRN, PRN
  DFF inst40 (.CLK(inst89_clk_out), .D(inst41_out), .Q(Lap05));  // open: CLRN, PRN
  DFF inst52 (.CLK(inst89_clk_out), .D(inst53_out), .Q(Lap15));  // open: CLRN, PRN
  DFF inst64 (.CLK(inst89_clk_out), .D(inst65_out), .Q(Lap25));  // open: CLRN, PRN
  DFF inst158 (.CLK(inst206_clk_out), .D(inst159_out), .Q(Lap204));  // open: CLRN, PRN
  DFF inst170 (.CLK(inst206_clk_out), .D(inst171_out), .Q(Lap214));  // open: CLRN, PRN
  DFF inst182 (.CLK(inst206_clk_out), .D(inst183_out), .Q(Lap224));  // open: CLRN, PRN
  DFF inst194 (.CLK(inst206_clk_out), .D(inst195_out), .Q(Lap234));  // open: CLRN, PRN
  DFF inst218 (.CLK(inst266_clk_out), .D(inst219_out), .Q(Lap304));  // open: CLRN, PRN
  DFF inst230 (.CLK(inst266_clk_out), .D(inst231_out), .Q(Lap314));  // open: CLRN, PRN
  DFF inst242 (.CLK(inst266_clk_out), .D(inst243_out), .Q(Lap324));  // open: CLRN, PRN
  DFF inst254 (.CLK(inst266_clk_out), .D(inst255_out), .Q(Lap334));  // open: CLRN, PRN
  DFF inst76 (.CLK(inst89_clk_out), .D(inst77_out), .Q(Lap35));  // open: CLRN, PRN
  FinProjT2 inst28 (
    .Reset(Reset), .Start(Start), .Clock(inst_tensecflag), .TenSecFlag(inst28_tensecflag), .A(A1), .B(B1),
    .C(C1), .D(D1), .E(E1), .F(F1), .G(G1));
  \21mux  inst101 (.\0 (Lap105), .S(y[1]), .\1 (F0), .Out(inst101_out));
  \21mux  inst113 (.\0 (Lap115), .S(y[1]), .\1 (F1), .Out(inst113_out));
  \21mux  inst125 (.\0 (Lap125), .S(y[1]), .\1 (F2), .Out(inst125_out));
  \21mux  inst137 (.\0 (Lap135), .S(y[1]), .\1 (F3), .Out(inst137_out));
  \21mux  inst79 (.\0 (Lap06), .S(y[0]), .\1 (G0), .Out(inst79_out));
  \21mux  inst81 (.\0 (Lap16), .S(y[0]), .\1 (G1), .Out(inst81_out));
  \21mux  inst85 (.\0 (Lap36), .S(y[0]), .\1 (G3), .Out(inst85_out));
  \21mux  inst161 (.\0 (Lap205), .S(y[2]), .\1 (F0), .Out(inst161_out));
  \21mux  inst173 (.\0 (Lap215), .S(y[2]), .\1 (F1), .Out(inst173_out));
  \21mux  inst185 (.\0 (Lap225), .S(y[2]), .\1 (F2), .Out(inst185_out));
  \21mux  inst197 (.\0 (Lap235), .S(y[2]), .\1 (F3), .Out(inst197_out));
  \21mux  inst221 (.\0 (Lap305), .S(y[3]), .\1 (F0), .Out(inst221_out));
  \21mux  inst233 (.\0 (Lap315), .S(y[3]), .\1 (F1), .Out(inst233_out));
  \21mux  inst245 (.\0 (Lap325), .S(y[3]), .\1 (F2), .Out(inst245_out));
  \21mux  inst257 (.\0 (Lap335), .S(y[3]), .\1 (F3), .Out(inst257_out));
  minute_decoder inst29 (
    .Reset(Reset), .Start(Start), .Clock(inst28_tensecflag), .TenSecFlag(inst29_tensecflag), .A(A2), .B(B2),
    .C(C2), .D(D2), .E(E2), .F(F2), .G(G2));
  \21mux  inst83 (.\0 (Lap26), .S(y[0]), .\1 (G2), .Out(inst83_out));
  DFF inst100 (.CLK(inst146_clk_out), .D(inst101_out), .Q(Lap105));  // open: CLRN, PRN
  DFF inst112 (.CLK(inst146_clk_out), .D(inst113_out), .Q(Lap115));  // open: CLRN, PRN
  DFF inst124 (.CLK(inst146_clk_out), .D(inst125_out), .Q(Lap125));  // open: CLRN, PRN
  DFF inst136 (.CLK(inst146_clk_out), .D(inst137_out), .Q(Lap135));  // open: CLRN, PRN
  DFF inst78 (.CLK(inst89_clk_out), .D(inst79_out), .Q(Lap06));  // open: CLRN, PRN
  DFF inst160 (.CLK(inst206_clk_out), .D(inst161_out), .Q(Lap205));  // open: CLRN, PRN
  DFF inst172 (.CLK(inst206_clk_out), .D(inst173_out), .Q(Lap215));  // open: CLRN, PRN
  DFF inst184 (.CLK(inst206_clk_out), .D(inst185_out), .Q(Lap225));  // open: CLRN, PRN
  DFF inst196 (.CLK(inst206_clk_out), .D(inst197_out), .Q(Lap235));  // open: CLRN, PRN
  DFF inst220 (.CLK(inst266_clk_out), .D(inst221_out), .Q(Lap305));  // open: CLRN, PRN
  DFF inst232 (.CLK(inst266_clk_out), .D(inst233_out), .Q(Lap315));  // open: CLRN, PRN
  DFF inst244 (.CLK(inst266_clk_out), .D(inst245_out), .Q(Lap325));  // open: CLRN, PRN
  DFF inst256 (.CLK(inst266_clk_out), .D(inst257_out), .Q(Lap335));  // open: CLRN, PRN
  DFF inst80 (.CLK(inst89_clk_out), .D(inst81_out), .Q(Lap16));  // open: CLRN, PRN
  DFF inst82 (.CLK(inst89_clk_out), .D(inst83_out), .Q(Lap26));  // open: CLRN, PRN
  DFF inst84 (.CLK(inst89_clk_out), .D(inst85_out), .Q(Lap36));  // open: CLRN, PRN
  \21mux  inst139 (.\0 (Lap106), .S(y[1]), .\1 (G0), .Out(inst139_out));
  \21mux  inst141 (.\0 (Lap116), .S(y[1]), .\1 (G1), .Out(inst141_out));
  \21mux  inst143 (.\0 (Lap126), .S(y[1]), .\1 (G2), .Out(inst143_out));
  \21mux  inst145 (.\0 (Lap136), .S(y[1]), .\1 (G3), .Out(inst145_out));
  \21mux  inst199 (.\0 (Lap206), .S(y[2]), .\1 (G0), .Out(inst199_out));
  \21mux  inst201 (.\0 (Lap216), .S(y[2]), .\1 (G1), .Out(inst201_out));
  \21mux  inst203 (.\0 (Lap226), .S(y[2]), .\1 (G2), .Out(inst203_out));
  \21mux  inst205 (.\0 (Lap236), .S(y[2]), .\1 (G3), .Out(inst205_out));
  \21mux  inst259 (.\0 (Lap306), .S(y[3]), .\1 (G0), .Out(inst259_out));
  \21mux  inst261 (.\0 (Lap316), .S(y[3]), .\1 (G1), .Out(inst261_out));
  \21mux  inst263 (.\0 (Lap326), .S(y[3]), .\1 (G2), .Out(inst263_out));
  \21mux  inst265 (.\0 (Lap336), .S(y[3]), .\1 (G3), .Out(inst265_out));
  DFF inst138 (.CLK(inst146_clk_out), .D(inst139_out), .Q(Lap106));  // open: CLRN, PRN
  DFF inst140 (.CLK(inst146_clk_out), .D(inst141_out), .Q(Lap116));  // open: CLRN, PRN
  DFF inst142 (.CLK(inst146_clk_out), .D(inst143_out), .Q(Lap126));  // open: CLRN, PRN
  DFF inst144 (.CLK(inst146_clk_out), .D(inst145_out), .Q(Lap136));  // open: CLRN, PRN
  DFF inst198 (.CLK(inst206_clk_out), .D(inst199_out), .Q(Lap206));  // open: CLRN, PRN
  DFF inst200 (.CLK(inst206_clk_out), .D(inst201_out), .Q(Lap216));  // open: CLRN, PRN
  DFF inst204 (.CLK(inst206_clk_out), .D(inst205_out), .Q(Lap236));  // open: CLRN, PRN
  DFF inst258 (.CLK(inst266_clk_out), .D(inst259_out), .Q(Lap306));  // open: CLRN, PRN
  DFF inst260 (.CLK(inst266_clk_out), .D(inst261_out), .Q(Lap316));  // open: CLRN, PRN
  DFF inst264 (.CLK(inst266_clk_out), .D(inst265_out), .Q(Lap336));  // open: CLRN, PRN
  FinProjT2 inst30 (
    .Reset(Reset), .Start(Start), .Clock(inst29_tensecflag), .A(A3), .B(B3), .C(C3), .D(D3), .E(E3), .F(F3),
    .G(G3));  // open: TenSecFlag
  DFF inst202 (.CLK(inst206_clk_out), .D(inst203_out), .Q(Lap226));  // open: CLRN, PRN
  DFF inst262 (.CLK(inst266_clk_out), .D(inst263_out), .Q(Lap326));  // open: CLRN, PRN

  // Other names for the same wires on the sheet: S0 = Select2; S1 = Select1
endmodule
